# Altium schematic sheet MB_adc_clk.SchDoc: Материнская плата
size 420 x 297 mm; DrawnBy: В.Титов; DocumentNumber: ХХХХ.468179.001 Э3; SheetNumber: 5; SheetTotal: 7; DocumentType: Схема электрическая принципиальная; Title2: Питание процессора
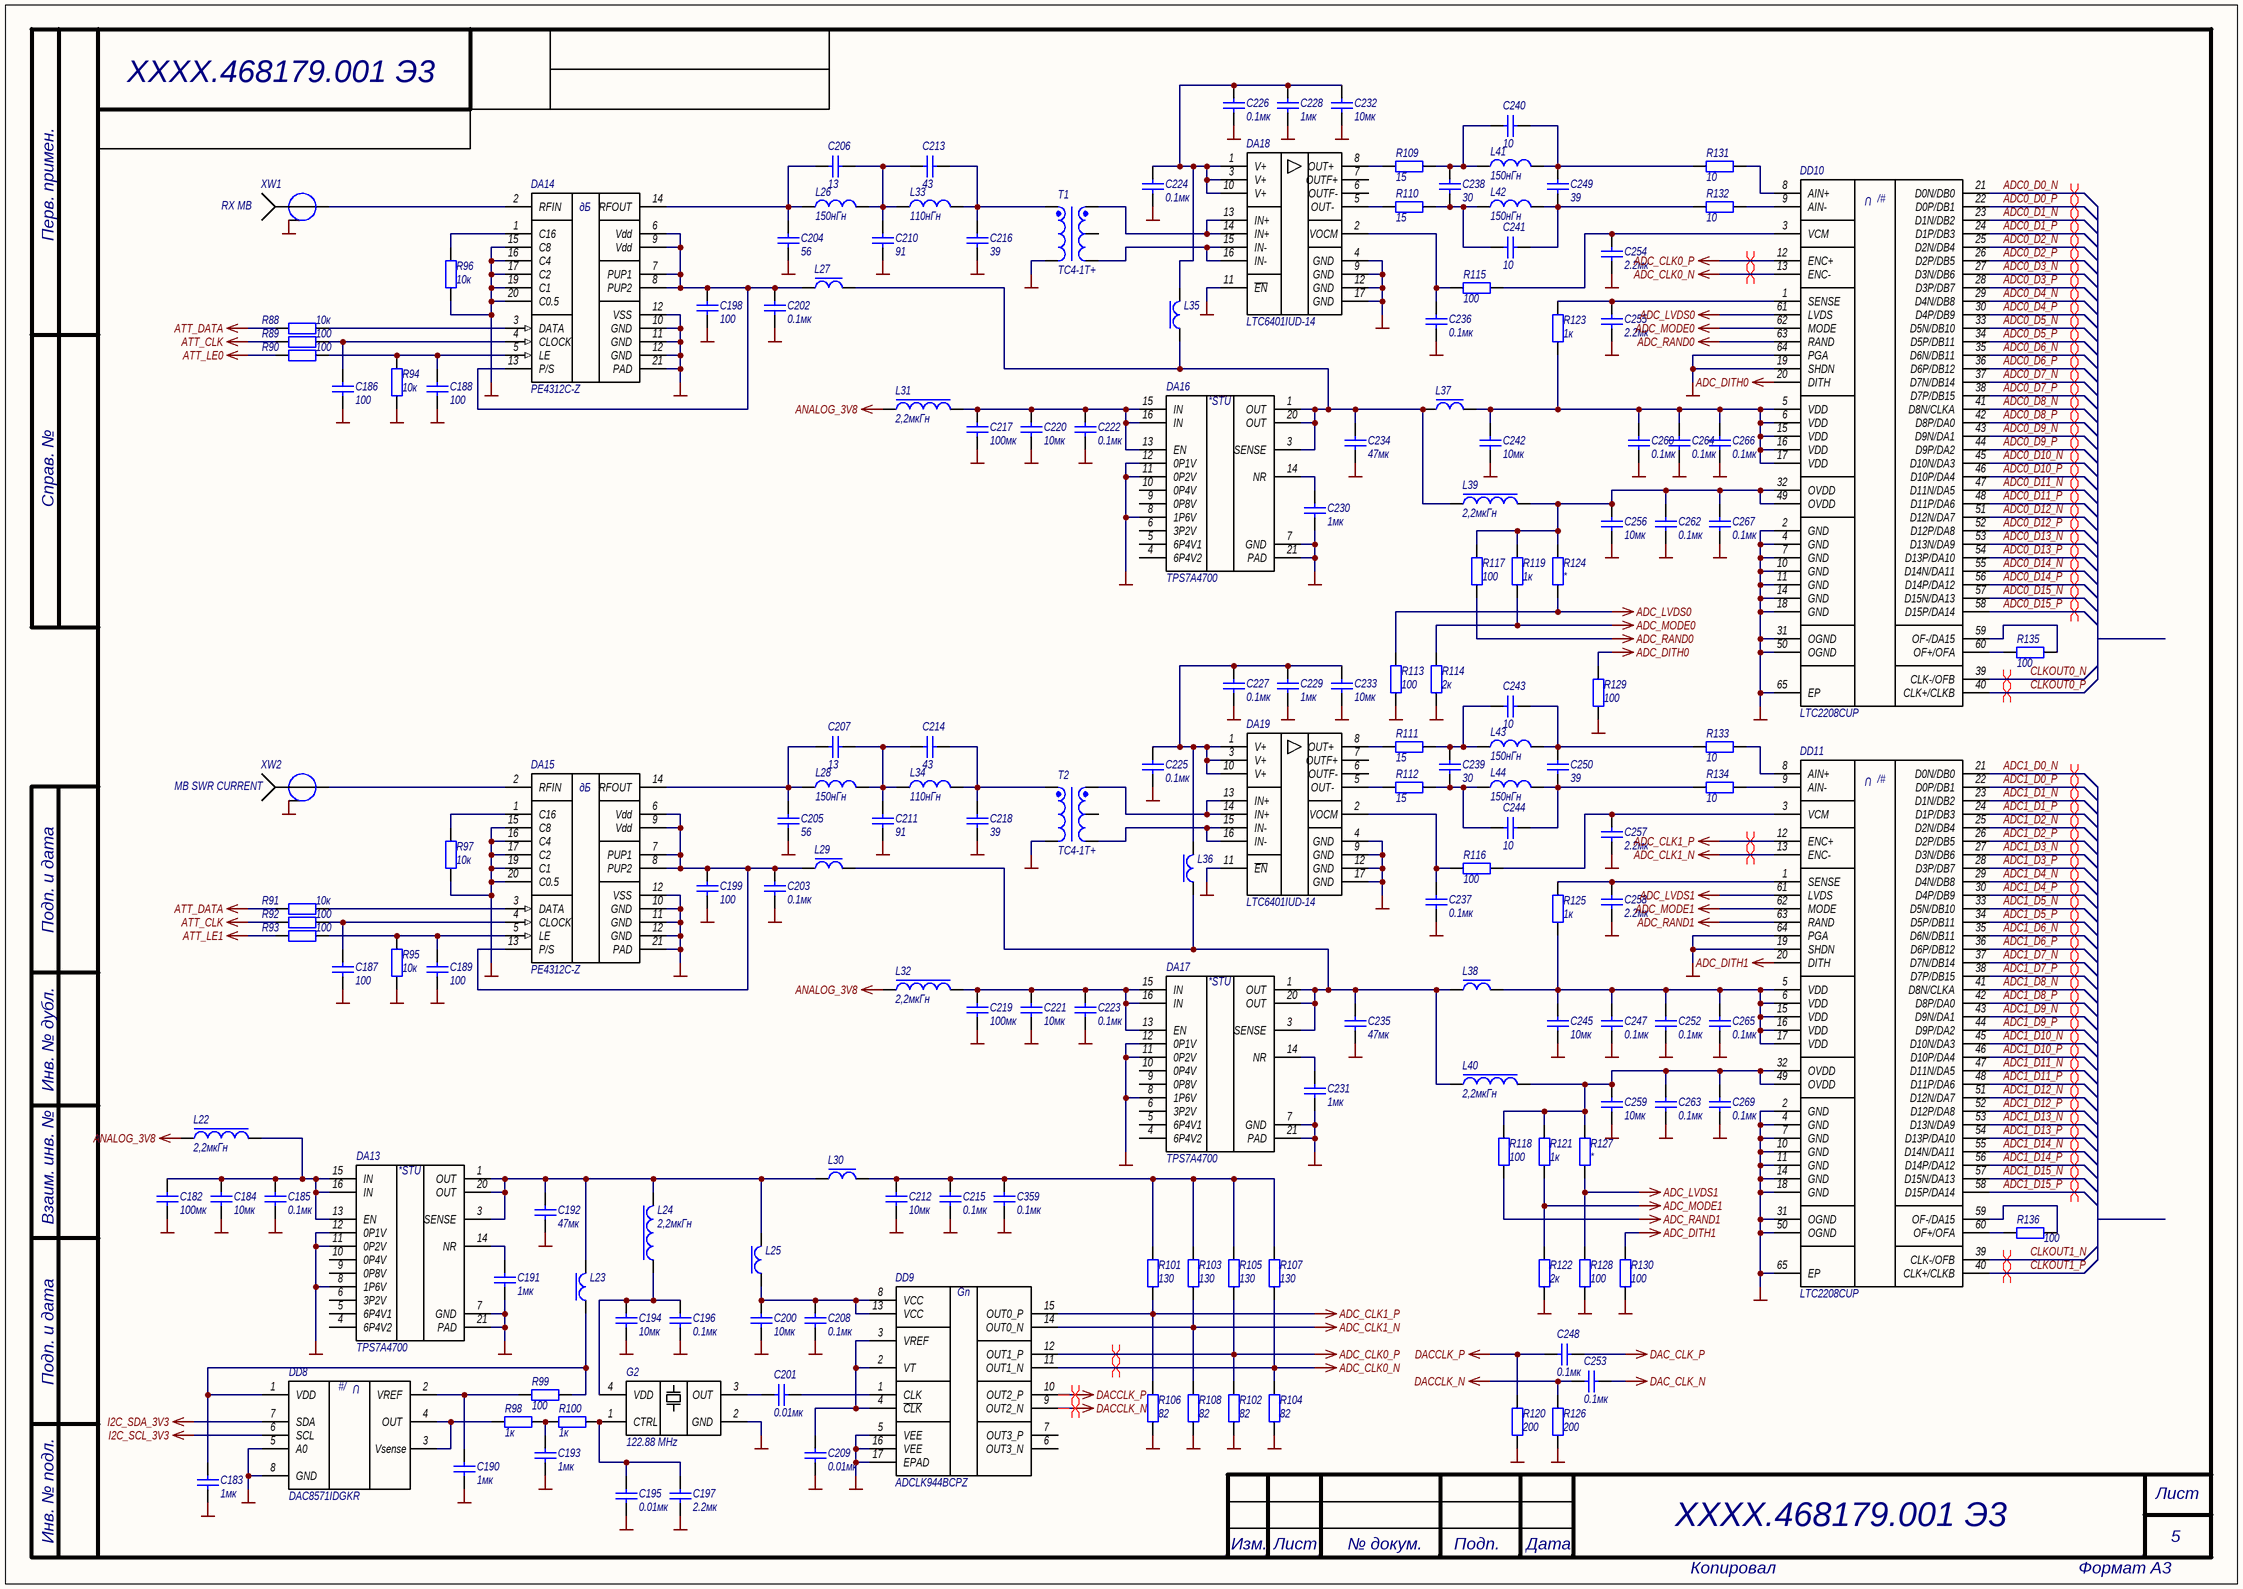
[diagram p0: MB_adc_clk.SchDoc]

## Parts
C182  100мк  [CAPC3216X19L]
C183  1мк  [CAPC1005X06N]
C184  10мк  [CAPC1608X08L]
C185  0.1мк  [CAPC1005X06N]
C186  100  [CAPC1005X06N]
C187  100  [CAPC1005X06N]
C188  100  [CAPC1005X06N]
C189  100  [CAPC1005X06N]
C190  1мк  [CAPC1005X06N]
C191  1мк  [CAPC1005X06N]
C192  47мк  [CAPC2012X12L]
C193  1мк  [CAPC1005X06N]
C194  10мк  [CAPC1608X08L]
C195  0.01мк  [CAPC1005X06N]
C196  0.1мк  [CAPC1005X06N]
C197  2.2мк  [CAPC1005X06N]
C198  100  [CAPC1005X06N]
C199  100  [CAPC1005X06N]
C200  10мк  [CAPC1608X08L]
C201  0.01мк  [CAPC1005X06N]
C202  0.1мк  [CAPC1005X06N]
C203  0.1мк  [CAPC1005X06N]
C204  56  [CAPC1005X06N]
C205  56  [CAPC1005X06N]
C206  13  [CAPC1005X06N]
C207  13  [CAPC1005X06N]
C208  0.1мк  [CAPC1005X06N]
C209  0.01мк  [CAPC1005X06N]
C210  91  [CAPC1005X06N]
C211  91  [CAPC1005X06N]
C212  10мк  [CAPC1608X08L]
C213  43  [CAPC1005X06N]
C214  43  [CAPC1005X06N]
C215  0.1мк  [CAPC1005X06N]
C216  39  [CAPC1005X06N]
C217  100мк  [CAPC3216X19L]
C218  39  [CAPC1005X06N]
C219  100мк  [CAPC3216X19L]
C220  10мк  [CAPC1608X08L]
C221  10мк  [CAPC1608X08L]
C222  0.1мк  [CAPC1005X06N]
C223  0.1мк  [CAPC1005X06N]
C224  0.1мк  [CAPC1005X06N]
C225  0.1мк  [CAPC1005X06N]
C226  0.1мк  [CAPC1005X06N]
C227  0.1мк  [CAPC1005X06N]
C228  1мк  [CAPC1005X06N]
C229  1мк  [CAPC1005X06N]
C230  1мк  [CAPC1005X06N]
C231  1мк  [CAPC1005X06N]
C232  10мк  [CAPC1608X08L]
C233  10мк  [CAPC1608X08L]
C234  47мк  [CAPC2012X12L]
C235  47мк  [CAPC2012X12L]
C236  0.1мк  [CAPC1005X06N]
C237  0.1мк  [CAPC1005X06N]
C238  30  [CAPC1005X06N]
C239  30  [CAPC1005X06N]
C240  10  [CAPC1005X06N]
C241  10  [CAPC1005X06N]
C242  10мк  [CAPC1608X08L]
C243  10  [CAPC1005X06N]
C244  10  [CAPC1005X06N]
C245  10мк  [CAPC1608X08L]
C247  0.1мк  [CAPC1005X06N]
C248  0.1мк  [CAPC1005X06N]
C249  39  [CAPC1005X06N]
C250  39  [CAPC1005X06N]
C252  0.1мк  [CAPC1005X06N]
C253  0.1мк  [CAPC1005X06N]
C254  2.2мк  [CAPC1005X06N]
C255  2.2мк  [CAPC1005X06N]
C256  10мк  [CAPC1608X08L]
C257  2.2мк  [CAPC1005X06N]
C258  2.2мк  [CAPC1005X06N]
C259  10мк  [CAPC1608X08L]
C260  0.1мк  [CAPC1005X06N]
C262  0.1мк  [CAPC1005X06N]
C263  0.1мк  [CAPC1005X06N]
C264  0.1мк  [CAPC1005X06N]
C265  0.1мк  [CAPC1005X06N]
C266  0.1мк  [CAPC1005X06N]
C267  0.1мк  [CAPC1005X06N]
C269  0.1мк  [CAPC1005X06N]
C359  0.1мк  [CAPC1005X06N]
DA13  TPS7A4700  [QFN65P500X500X100_HS-21L]
DA14  PE4312C-Z  [QFN50P400X400X80_HS-21L]
DA15  PE4312C-Z  [QFN50P400X400X80_HS-21L]
DA16  TPS7A4700  [QFN65P500X500X100_HS-21L]
DA17  TPS7A4700  [QFN65P500X500X100_HS-21L]
DA18  LTC6401IUD-14  [QFN50P300X300X75_HS-17L]
DA19  LTC6401IUD-14  [QFN50P300X300X75_HS-17L]
DD8  DAC8571IDGKR  [TSOP65P490X110-8L]
DD9  ADCLK944BCPZ  [QFN50P300X300X100_HS-17L]
DD10  LTC2208CUP  [QFN50P900X900X100_HS-65L]
DD11  LTC2208CUP  [QFN50P900X900X100_HS-65L]
G2  122.88 MHz  [CVHD-950 Model]
L22  2,2мкГн  [CSAB0420]
L23  BLM18PG121SN1D  [INDC1608X08L]  (value not drawn)
L24  2,2мкГн  [CSAB0420]
L25  BLM18PG121SN1D  [INDC1608X08L]  (value not drawn)
L26  150нГн  [INDC0805CS]
L27  BLM18PG121SN1D  [INDC1608X08L]  (value not drawn)
L28  150нГн  [INDC0805CS]
L29  BLM18PG121SN1D  [INDC1608X08L]  (value not drawn)
L30  BLM18PG121SN1D  [INDC1608X08L]  (value not drawn)
L31  2,2мкГн  [CSAB0420]
L32  2,2мкГн  [CSAB0420]
L33  110нГн  [INDC0805CS]
L34  110нГн  [INDC0805CS]
L35  BLM18PG121SN1D  [INDC1608X08L]  (value not drawn)
L36  BLM18PG121SN1D  [INDC1608X08L]  (value not drawn)
L37  BLM18PG121SN1D  [INDC1608X08L]  (value not drawn)
L38  BLM18PG121SN1D  [INDC1608X08L]  (value not drawn)
L39  2,2мкГн  [CSAB0420]
L40  2,2мкГн  [CSAB0420]
L41  150нГн  [INDC0805CS]
L42  150нГн  [INDC0805CS]
L43  150нГн  [INDC0805CS]
L44  150нГн  [INDC0805CS]
R88  10к  [RESC1005X06N]
R89  100  [RESC1005X06N]
R90  100  [RESC1005X06N]
R91  10к  [RESC1005X06N]
R92  100  [RESC1005X06N]
R93  100  [RESC1005X06N]
R94  10к  [RESC1005X06N]
R95  10к  [RESC1005X06N]
R96  10к  [RESC1005X06N]
R97  10к  [RESC1005X06N]
R98  1к  [RESC1005X06N]
R99  100  [RESC1005X06N]
R100  1к  [RESC1005X06N]
R101  130  [RESC1005X06N]
R102  82  [RESC1005X06N]
R103  130  [RESC1005X06N]
R104  82  [RESC1005X06N]
R105  130  [RESC1005X06N]
R106  82  [RESC1005X06N]
R107  130  [RESC1005X06N]
R108  82  [RESC1005X06N]
R109  15  [RESC1005X06N]
R110  15  [RESC1005X06N]
R111  15  [RESC1005X06N]
R112  15  [RESC1005X06N]
R113  100  [RESC1005X06N]
R114  2к  [RESC1005X06N]
R115  100  [RESC1005X06N]
R116  100  [RESC1005X06N]
R117  100  [RESC1005X06N]
R118  100  [RESC1005X06N]
R119  1к  [RESC1005X06N]
R120  200  [RESC1005X06N]
R121  1к  [RESC1005X06N]
R122  2к  [RESC1005X06N]
R123  1к  [RESC1005X06N]
R124  *  [RESC1005X06N]
R125  1к  [RESC1005X06N]
R126  200  [RESC1005X06N]
R127  *  [RESC1005X06N]
R128  100  [RESC1005X06N]
R129  100  [RESC1005X06N]
R130  100  [RESC1005X06N]
R131  10  [RESC1005X06N]
R132  10  [RESC1005X06N]
R133  10  [RESC1005X06N]
R134  10  [RESC1005X06N]
R135  100  [RESC1005X06N]
R136  100  [RESC1005X06N]
T1  TC4-1T+  [SM-22 package]
T2  TC4-1T+  [SM-22 package]
XW1  SMA-JR  [SMA-JR]  (value not drawn)
XW2  SMA-JR  [SMA-JR]  (value not drawn)

## Nets
ADC_CLK0_N: DD9.11(OUT1_N) DD10.13(ENC-) R104.1 R107.2
ADC_CLK0_P: DD9.12(OUT1_P) DD10.12(ENC+) R102.1 R105.2
ADC_CLK1_N: DD9.14(OUT0_N) DD11.13(ENC-) R103.2 R108.1
ADC_CLK1_P: DD9.15(OUT0_P) DD11.12(ENC+) R101.2 R106.1
ADC_DITH0: DD10.20(DITH) R129.1
ADC_DITH1: DD11.20(DITH) R130.1
ADC_LVDS0: DD10.61(LVDS) R113.1 R124.2
ADC_LVDS1: DD11.61(LVDS) R127.2 R128.1
ADC_MODE0: DD10.62(MODE) R114.1 R119.2
ADC_MODE1: DD11.62(MODE) R121.2 R122.1
ADC_RAND0: DD10.63(RAND) R117.2
ADC_RAND1: DD11.63(RAND) R118.2
ANALOG_3V8: L22.1 L31.1 L32.1
ATT_CLK: R89.2 R92.2
ATT_DATA: R88.2 R91.2
ATT_LE0: R90.2
ATT_LE1: R93.2
DAC_CLK_N: C253.1
DAC_CLK_P: C248.1
DACCLK_N: C253.2 DD9.9(OUT2_N) R126.1
DACCLK_P: C248.2 DD9.10(OUT2_P) R120.1
GND: C182.1 C183.2 C184.1 C185.1 C186.1 C187.1 C188.1 C189.1 C190.2 C191.1 C192.1 C193.2 C194.1 C195.2 C196.1 C197.1 C198.1 C199.1 C200.1 C202.1 C203.1 C204.1 C205.1 C208.1 C209.2 C210.1 C211.1 C212.1 C215.1 C216.1 C217.1 C218.1 C219.1 C220.1 C221.1 C222.1 C223.1 C224.1 C225.1 C226.1 C227.1 C228.1 C229.1 C230.1 C231.1 C232.1 C233.1 C234.1 C235.1 C236.1 C237.1 C242.1 C245.1 C247.1 C252.1 C254.1 C255.1 C256.1 C257.1 C258.1 C259.1 C260.1 C262.1 C263.1 C264.1 C265.1 C266.1 C267.1 C269.1 C359.1 DA13.7(GND) DA13.8(1P6V) DA13.11(0P2V) DA13.12(0P1V) DA13.21(PAD) DA14.10(GND) DA14.11(GND) DA14.12(VSS) DA14.15(C8) DA14.16(C4) DA14.17(C2) DA14.19(C1) DA14.20(C0.5) DA14.21(PAD) DA15.10(GND) DA15.11(GND) DA15.12(VSS) DA15.15(C8) DA15.16(C4) DA15.17(C2) DA15.19(C1) DA15.20(C0.5) DA15.21(PAD) DA16.7(GND) DA16.8(1P6V) DA16.11(0P2V) DA16.12(0P1V) DA16.21(PAD) DA17.7(GND) DA17.8(1P6V) DA17.11(0P2V) DA17.12(0P1V) DA17.21(PAD) DA18.4(GND) DA18.9(GND) DA18.11(~{EN}) DA18.12(GND) DA18.17(GND) DA19.4(GND) DA19.9(GND) DA19.11(~{EN}) DA19.12(GND) DA19.17(GND) DD8.5(A0) DD8.8(GND) DD9.5(VEE) DD9.16(VEE) DD9.17(EPAD) DD10.2(GND) DD10.4(GND) DD10.7(GND) DD10.10(GND) DD10.11(GND) DD10.14(GND) DD10.18(GND) DD10.19(SHDN) DD10.31(OGND) DD10.50(OGND) DD10.64(PGA) DD10.65(EP) DD11.2(GND) DD11.4(GND) DD11.7(GND) DD11.10(GND) DD11.11(GND) DD11.14(GND) DD11.18(GND) DD11.19(SHDN) DD11.31(OGND) DD11.50(OGND) DD11.64(PGA) DD11.65(EP) G2.2(GND) R94.2 R95.2 R96.1 R97.1 R102.2 R104.2 R106.2 R108.2 R113.2 R114.2 R120.2 R122.2 R126.2 R128.2 R129.2 R130.2 T1.4(PRIMARY) T2.4(PRIMARY) XW1.2 XW2.2
I2C_SCL_3V3: DD8.6(SCL)
I2C_SDA_3V3: DD8.7(SDA)
ADC0_D0_N: DD10.21(D0N/DB0)
ADC0_D0_P: DD10.22(D0P/DB1)
ADC0_D1_N: DD10.23(D1N/DB2)
ADC0_D1_P: DD10.24(D1P/DB3)
ADC0_D2_N: DD10.25(D2N/DB4)
ADC0_D2_P: DD10.26(D2P/DB5)
ADC0_D3_N: DD10.27(D3N/DB6)
ADC0_D3_P: DD10.28(D3P/DB7)
ADC0_D4_N: DD10.29(D4N/DB8)
ADC0_D4_P: DD10.30(D4P/DB9)
ADC0_D5_N: DD10.33(D5N/DB10)
ADC0_D5_P: DD10.34(D5P/DB11)
ADC0_D6_N: DD10.35(D6N/DB11)
ADC0_D6_P: DD10.36(D6P/DB12)
ADC0_D7_N: DD10.37(D7N/DB14)
ADC0_D7_P: DD10.38(D7P/DB15)
ADC0_D8_N: DD10.41(D8N/CLKA)
ADC0_D8_P: DD10.42(D8P/DA0)
ADC0_D9_N: DD10.43(D9N/DA1)
ADC0_D9_P: DD10.44(D9P/DA2)
ADC0_D10_N: DD10.45(D10N/DA3)
ADC0_D10_P: DD10.46(D10P/DA4)
ADC0_D11_N: DD10.47(D11N/DA5)
ADC0_D11_P: DD10.48(D11P/DA6)
ADC0_D12_N: DD10.51(D12N/DA7)
ADC0_D12_P: DD10.52(D12P/DA8)
ADC0_D13_N: DD10.53(D13N/DA9)
ADC0_D13_P: DD10.54(D13P/DA10)
ADC0_D14_N: DD10.55(D14N/DA11)
ADC0_D14_P: DD10.56(D14P/DA12)
ADC0_D15_N: DD10.57(D15N/DA13)
ADC0_D15_P: DD10.58(D15P/DA14)
ADC1_D0_N: DD11.21(D0N/DB0)
ADC1_D0_P: DD11.22(D0P/DB1)
ADC1_D1_N: DD11.23(D1N/DB2)
ADC1_D1_P: DD11.24(D1P/DB3)
ADC1_D2_N: DD11.25(D2N/DB4)
ADC1_D2_P: DD11.26(D2P/DB5)
ADC1_D3_N: DD11.27(D3N/DB6)
ADC1_D3_P: DD11.28(D3P/DB7)
ADC1_D4_N: DD11.29(D4N/DB8)
ADC1_D4_P: DD11.30(D4P/DB9)
ADC1_D5_N: DD11.33(D5N/DB10)
ADC1_D5_P: DD11.34(D5P/DB11)
ADC1_D6_N: DD11.35(D6N/DB11)
ADC1_D6_P: DD11.36(D6P/DB12)
ADC1_D7_N: DD11.37(D7N/DB14)
ADC1_D7_P: DD11.38(D7P/DB15)
ADC1_D8_N: DD11.41(D8N/CLKA)
ADC1_D8_P: DD11.42(D8P/DA0)
ADC1_D9_N: DD11.43(D9N/DA1)
ADC1_D9_P: DD11.44(D9P/DA2)
ADC1_D10_N: DD11.45(D10N/DA3)
ADC1_D10_P: DD11.46(D10P/DA4)
ADC1_D11_N: DD11.47(D11N/DA5)
ADC1_D11_P: DD11.48(D11P/DA6)
ADC1_D12_N: DD11.51(D12N/DA7)
ADC1_D12_P: DD11.52(D12P/DA8)
ADC1_D13_N: DD11.53(D13N/DA9)
ADC1_D13_P: DD11.54(D13P/DA10)
ADC1_D14_N: DD11.55(D14N/DA11)
ADC1_D14_P: DD11.56(D14P/DA12)
ADC1_D15_N: DD11.57(D15N/DA13)
ADC1_D15_P: DD11.58(D15P/DA14)
CLKOUT0_N: DD10.39(CLK-/OFB)
CLKOUT0_P: DD10.40(CLK+/CLKB)
CLKOUT1_N: DD11.39(CLK-/OFB)
CLKOUT1_P: DD11.40(CLK+/CLKB)
NetC182_2: C182.2 C184.2 C185.2 DA13.13(EN) DA13.15(IN) DA13.16(IN) L22.2
NetC183_1: C183.1 DD8.1(VDD) L23.1 R99.2
NetC186_2: C186.2 DA14.4(CLOCK) R89.1
NetC187_2: C187.2 DA15.4(CLOCK) R92.1
NetC188_2: C188.2 DA14.5(LE) R90.1 R94.1
NetC189_2: C189.2 DA15.5(LE) R93.1 R95.1
NetC190_1: C190.1 DD8.2(VREF) R99.1
NetC191_2: C191.2 DA13.14(NR)
NetC192_2: C192.2 DA13.1(OUT) DA13.3(SENSE) DA13.20(OUT) L23.2 L24.2 L25.2 L30.1
NetC193_1: C193.1 R98.2 R100.1
NetC194_2: C194.2 C196.2 G2.4(VDD) L24.1
NetC195_1: C195.1 C197.2 G2.1(CTRL) R100.2
NetC198_2: C198.2 C202.2 DA14.6(Vdd) DA14.7(PUP1) DA14.8(PUP2) DA14.9(Vdd) DA14.13(P/S) L27.1
NetC199_2: C199.2 C203.2 DA15.6(Vdd) DA15.7(PUP1) DA15.8(PUP2) DA15.9(Vdd) DA15.13(P/S) L29.1
NetC200_2: C200.2 C208.2 DD9.8(VCC) DD9.13(VCC) L25.1
NetC201_1: C201.1 DD9.1(CLK)
NetC201_2: C201.2 G2.3(OUT)
NetC204_2: C204.2 C206.2 DA14.14(RFOUT) L26.1
NetC205_2: C205.2 C207.2 DA15.14(RFOUT) L28.1
NetC206_1: C206.1 C210.2 C213.2 L26.2 L33.1
NetC207_1: C207.1 C211.2 C214.2 L28.2 L34.1
NetC209_1: C209.1 DD9.2(VT) DD9.3(VREF) DD9.4(~{CLK})
NetC212_2: C212.2 C215.2 C359.2 L30.2 R101.1 R103.1 R105.1 R107.1
NetC213_1: C213.1 C216.2 L33.2 T1.5(PRIMARY_DOT)
NetC214_1: C214.1 C218.2 L34.2 T2.5(PRIMARY_DOT)
NetC217_2: C217.2 C220.2 C222.2 DA16.13(EN) DA16.15(IN) DA16.16(IN) L31.2
NetC219_2: C219.2 C221.2 C223.2 DA17.13(EN) DA17.15(IN) DA17.16(IN) L32.2
NetC224_2: C224.2 C226.2 C228.2 C232.2 DA18.1(V+) DA18.3(V+) DA18.10(V+) L35.2
NetC225_2: C225.2 C227.2 C229.2 C233.2 DA19.1(V+) DA19.3(V+) DA19.10(V+) L36.2
NetC230_2: C230.2 DA16.14(NR)
NetC231_2: C231.2 DA17.14(NR)
NetC234_2: C234.2 DA16.1(OUT) DA16.3(SENSE) DA16.20(OUT) L27.2 L35.1 L37.1 L39.1
NetC235_2: C235.2 DA17.1(OUT) DA17.3(SENSE) DA17.20(OUT) L29.2 L36.1 L38.1 L40.1
NetC236_2: C236.2 DA18.2(VOCM) R115.1
NetC237_2: C237.2 DA19.2(VOCM) R116.1
NetC238_1: C238.1 C241.2 L42.1 R110.2
NetC238_2: C238.2 C240.2 L41.1 R109.2
NetC239_1: C239.1 C244.2 L44.1 R112.2
NetC239_2: C239.2 C243.2 L43.1 R111.2
NetC240_1: C240.1 C249.2 L41.2 R131.1
NetC241_1: C241.1 C249.1 L42.2 R132.1
NetC242_2: C242.2 C260.2 C264.2 C266.2 DD10.5(VDD) DD10.6(VDD) DD10.15(VDD) DD10.16(VDD) DD10.17(VDD) L37.2 R123.2
NetC243_1: C243.1 C250.2 L43.2 R133.1
NetC244_1: C244.1 C250.1 L44.2 R134.1
NetC245_2: C245.2 C247.2 C252.2 C265.2 DD11.5(VDD) DD11.6(VDD) DD11.15(VDD) DD11.16(VDD) DD11.17(VDD) L38.2 R125.2
NetC254_2: C254.2 DD10.3(VCM) R115.2
NetC255_2: C255.2 DD10.1(SENSE) R123.1
NetC256_2: C256.2 C262.2 C267.2 DD10.32(OVDD) DD10.49(OVDD) L39.2 R117.1 R119.1 R124.1
NetC257_2: C257.2 DD11.3(VCM) R116.2
NetC258_2: C258.2 DD11.1(SENSE) R125.1
NetC259_2: C259.2 C263.2 C269.2 DD11.32(OVDD) DD11.49(OVDD) L40.2 R118.1 R121.1 R127.1
NetDA14_1: DA14.1(C16) R96.2
NetDA14_2: DA14.2(RFIN) XW1.1
NetDA14_3: DA14.3(DATA) R88.1
NetDA15_1: DA15.1(C16) R97.2
NetDA15_2: DA15.2(RFIN) XW2.1
NetDA15_3: DA15.3(DATA) R91.1
NetDA18_5: DA18.5(GND) R110.1
NetDA18_8: DA18.8(OUT+) R109.1
NetDA18_13: DA18.13(IN+) DA18.14(IN+) T1.1(SECONDARY_DOT)
NetDA18_15: DA18.15(IN-) DA18.16(IN-) T1.3(SECONDARY)
NetDA19_5: DA19.5(GND) R112.1
NetDA19_8: DA19.8(OUT+) R111.1
NetDA19_13: DA19.13(IN+) DA19.14(IN+) T2.1(SECONDARY_DOT)
NetDA19_15: DA19.15(IN-) DA19.16(IN-) T2.3(SECONDARY)
NetDD8_3: DD8.3(Vsense) DD8.4(OUT) R98.1
NetDD10_8: DD10.8(AIN+) R131.2
NetDD10_9: DD10.9(AIN-) R132.2
NetDD10_59: DD10.59(OF-/DA15) R135.1
NetDD10_60: DD10.60(OF+/OFA) R135.2
NetDD11_8: DD11.8(AIN+) R133.2
NetDD11_9: DD11.9(AIN-) R134.2
NetDD11_59: DD11.59(OF-/DA15) R136.1
NetDD11_60: DD11.60(OF+/OFA) R136.2

Not connected (* = marked no-connect by the designer): DA13 4(6P4V2) 5(6P4V1) 6(3P2V) 9(0P8V) 10(0P4V); DA16 4(6P4V2) 5(6P4V1) 6(3P2V) 9(0P8V) 10(0P4V); DA17 4(6P4V2) 5(6P4V1) 6(3P2V) 9(0P8V) 10(0P4V); DA18 6(OUTF-) 7(OUTF+); DA19 6(OUTF-) 7(OUTF+); DD9 6(OUT3_N) 7(OUT3_P); T1 2(SECONARY_CT); T2 2(SECONARY_CT)

## Layout directives
differential pair: ADC0_D0_N, ADC0_D0_P, ADC0_D1_N, ADC0_D1_P, ADC0_D2_N, ADC0_D2_P, ADC0_D3_N, ADC0_D3_P, ADC0_D4_N, ADC0_D4_P, ADC0_D5_N, ADC0_D5_P, ADC0_D6_N, ADC0_D6_P, ADC0_D7_N, ADC0_D7_P, ADC0_D8_N, ADC0_D8_P, ADC0_D9_N, ADC0_D9_P, ADC0_D10_N, ADC0_D10_P, ADC0_D11_N, ADC0_D11_P, ADC0_D12_N, ADC0_D12_P, ADC0_D13_N, ADC0_D13_P, ADC0_D14_N, ADC0_D14_P, ADC0_D15_N, ADC0_D15_P, ADC1_D0_N, ADC1_D0_P, ADC1_D1_N, ADC1_D1_P, ADC1_D2_N, ADC1_D2_P, ADC1_D3_N, ADC1_D3_P, ADC1_D4_N, ADC1_D4_P, ADC1_D5_N, ADC1_D5_P, ADC1_D6_N, ADC1_D6_P, ADC1_D7_N, ADC1_D7_P, ADC1_D8_N, ADC1_D8_P, ADC1_D9_N, ADC1_D9_P, ADC1_D10_N, ADC1_D10_P, ADC1_D11_N, ADC1_D11_P, ADC1_D12_N, ADC1_D12_P, ADC1_D13_N, ADC1_D13_P, ADC1_D14_N, ADC1_D14_P, ADC1_D15_N, ADC1_D15_P, ADC_CLK0_N, ADC_CLK0_P, ADC_CLK1_N, ADC_CLK1_P, CLKOUT0_N, CLKOUT0_P, CLKOUT1_N, CLKOUT1_P, DACCLK_N, DACCLK_P

## Notes on the sheet
- (near XW1) RX MB
- (near XW2) MB SWR CURRENT
- Перв. примен.
- Справ. №
- Подп. и дата
- Инв. № дубл.
- Взаим. инв. №
- Инв. № подл.
- Лист
- Изм.
- № докум.
- Подп.
- Дата
- Копировал
- Формат А3
- (in symbol Микросхема ADCLK944BCPZ) Gn
- (in symbol Микросхема DAC8571IDGKR) U; #/
- (in symbol Микросхема LTC2208CUP) U; /#
- (in symbol Микросхема PE4312C-Z) дБ
- (in symbol Микросхема TPS7A4700RGW) *STU

## Library data of the parts
C182 C217 C219 = Кер.ЧИП конд. 1206 100мкФ X5R 20% 6.3В: Кер. ЧИП-конденсатор; Manufacturer: Murata; ManufacturerPartNumber: GRM31CR60J107ME39L; Power/Voltage: 6.3В; TKE: X5R; Tolerance: ±20%; Value: 100мк
C183 C190 C191 C193 C228-C231 = Кер.ЧИП конд. 0402 1мкФ X5R 10%, 10В: Кер. ЧИП-конденсатор; Power/Voltage: 10В; TKE: X5R; Tolerance: ±10%; Value: 1мк; PackageReference: 0402
C184 C194 C200 C212 C220 C221 C232 C233 C242 C245 C256 C259 = Кер.ЧИП конд. 0603 10мкФ X5R 20% 6.3В: Кер. ЧИП-конденсатор; Manufacturer: Murata; ManufacturerPartNumber: GRM188R61A106KE69D; Power/Voltage: 6.3В; TKE: X5R; Tolerance: ±20%; Value: 10мк
C185 C196 C202 C203 C208 C215 C222-C227 C236 C237 C247 C248 C252 C253 C260 C262-C267 C269 C359 = Кер.ЧИП конд. 0402 0.1мкФ X7R 10%, 16В: Кер. ЧИП-конденсатор; Power/Voltage: 16В; TKE: X7R; Tolerance: ±10%; PackageReference: 0402; Value: 0.1мк
C186-C189 C198 C199 = Кер.ЧИП конд. 0402 100пФ NPO 5%, 50В: Кер. ЧИП-конденсатор; Power/Voltage: 50В; TKE: NPO; Tolerance: ±5%; PackageReference: 0402; Value: 100
C192 C234 C235 = Кер.ЧИП конд. 0805 47мкФ X5R 20% 10В: Кер. ЧИП-конденсатор; Manufacturer: Murata; ManufacturerPartNumber: GRM21BR61A476ME15L; Power/Voltage: 10В; TKE: X5R; Tolerance: ±20%; Value: 47мк
C195 C201 C209 = Кер.ЧИП конд. 0402 0.01мкФ X7R 10%, 50В: Кер. ЧИП-конденсатор; Power/Voltage: 50В; TKE: X7R; Tolerance: ±20%; Value: 0.01мк
C197 C254 C255 C257 C258 = Кер.ЧИП конд. 0402 2.2мкФ X5R 20%, 6.3В: Кер. ЧИП-конденсатор; Power/Voltage: 6.3В; TKE: X5R; Tolerance: ±20%; PackageReference: 0402; Value: 2.2мк
C204 C205 = Кер.ЧИП конд. 0402 56пФ NPO 5%, 50В: Кер. ЧИП-конденсатор; Power/Voltage: 50В; TKE: NPO; Tolerance: ±5%; PackageReference: 0402; Value: 56
C206 C207 = Кер.ЧИП конд. 0402 13пФ NPO 5%, 50В: Кер. ЧИП-конденсатор; Power/Voltage: 50В; TKE: NPO; Tolerance: ±5%; Value: 13; PackageReference: 0402
C210 C211 = Кер.ЧИП конд. 0402 91пФ NPO 5%, 50В: Кер. ЧИП-конденсатор; Power/Voltage: 50В; TKE: NPO; Tolerance: ±5%; PackageReference: 0402; Value: 91
C213 C214 = Кер.ЧИП конд. 0402 43пФ NPO 5%, 50В: Кер. ЧИП-конденсатор; Power/Voltage: 50В; TKE: NPO; Tolerance: ±5%; Value: 43; PackageReference: 0402
C216 C218 C249 C250 = Кер.ЧИП конд. 0402 39пФ NPO 5%, 50В: Кер. ЧИП-конденсатор; Power/Voltage: 50В; TKE: NPO; Tolerance: ±5%; PackageReference: 0402; Value: 39
C238 C239 = Кер.ЧИП конд. 0402 30пФ NPO 5%, 50В: Кер. ЧИП-конденсатор; Power/Voltage: 50В; TKE: NPO; Tolerance: ±5%; PackageReference: 0402; Value: 30
C240 C241 C243 C244 = Кер.ЧИП конд. 0402 10пФ NPO 5%, 50В: Кер. ЧИП-конденсатор; Power/Voltage: 50В; TKE: NPO; Tolerance: ±5%; PackageReference: 0402; Value: 10
DA13 DA16 DA17 = Микросхема TPS7A4700RGW: 36-V, 1-A, 4-µVRMS, RF LDO Voltage Regulator; Manufacturer: TI; Value: TPS7A4700; ComponentLink1Description: datasheet; ComponentLink1URL: http://www.ti.com/lit/ds/symlink/tps7a47.pdf
DA14 DA15 = Микросхема PE4312C-Z: RF Digital Step Attenuator 6-bit, 31.5 dB, 1 MHz–4 GHz; Manufacturer: Peregrine; Value: PE4312C-Z; ComponentLink1Description: datasheet; ComponentLink1URL: https://www.psemi.com/pdf/datasheets/pe4312ds.pdf
DA18 DA19 = Микросхема LTC6401IUD-14: 2GHz Low Noise, Low  Distortion Differential ADC  Driver for DC-140MHz; Manufacturer: LINEAR TECHNOLOGY; Value: LTC6401IUD-14; ComponentLink1Description: datasheet; ComponentLink1URL: http://cds.linear.com/docs/en/datasheet/640114f.pdf
DD8 = Микросхема DAC8571IDGKR: 16-BIT, LOW POWER, VOLTAGE OUTPUT, I2C INTERFACE DIGITAL-TO-ANALOG  CONVERTER; Manufacturer: TI; Value: DAC8571IDGKR; ComponentLink1Description: datasheet; ComponentLink1URL: http://www.ti.com/lit/ds/slas373a/slas373a.pdf
DD9 = Микросхема ADCLK944BCPZ: 2.5 V/3.3 V, Four LVPECL Outputs,  SiGe Clock Fanout Buffer; Manufacturer: TI; Value: ADCLK944BCPZ; ComponentLink1Description: datasheet; ComponentLink1URL: http://www.analog.com/media/en/technical-documentation/data-sheets/ADCLK944.pdf
DD10 DD11 = Микросхема LTC2208CUP: 16-Bit, 130Msps ADC; Manufactured: Linear; Value: LTC2208CUP; ComponentLink1Description: datasheet; ComponentLink1URL: https://www.analog.com/media/en/technical-documentation/data-sheets/2208fc.pdf
G2 = Генератор кварцевый CVHD-950-122.880: 122.88 MHz Ultra-Low Phase Noise Oscillator; Manufacturer: Crystek crystals; Value: 122.88 MHz; ComponentLink1Description: datasheet; ComponentLink1URL: http://www.rakon.com/products/families/tcxo
L22 L24 L31 L32 L39 L40 = ЧИП индуктивность CSAB0420-2R2M: Molding Power Choke; Manufacturer: Vishay; ManufacturerPartNumber: IHLP1616ABER1R0M11; Value: 2,2мкГн
L23 L25 L27 L29 L30 L35-L38 = ЧИП дроссель 0603 BLM18PG121SN1D: SMD EMI Suppression Filter EMIFIL; Manufacturer: Murata; ManufacturerPartNumber: BLM18PG121SN1D; Value: BLM18PG121SN1D
L26 L28 = ЧИП индуктивность 0805CS-151XGL: Value: 150нГн
L33 L34 = ЧИП индуктивность 0805CS-111XGL: Value: 110нГн
L41-L44 = ЧИП индуктивность 0805CS-150XJL: Value: 150нГн
R88 R91 R94-R97 = Чип резистор 0402 10 кОм, 5%: ЧИП-резистор; Tolerance: ±5%; TKE: 100 ppm/°С; PackageReference: 0402; Value: 10к
R89 R90 R92 R93 R99 R113 R115-R118 R128-R130 R135 R136 = Чип резистор 0402 100 Ом, 5%: ЧИП-резистор; Tolerance: ±5%; TKE: 100 ppm/°С; PackageReference: 0402; Value: 100
R98 R100 R119 R121 R123 R125 = Чип резистор 0402 1 кОм, 5%: ЧИП-резистор; Tolerance: ±5%; TKE: 100 ppm/°С; PackageReference: 0402; Value: 1к
R101 R103 R105 R107 = Чип резистор 0402 130 Ом, 5%: ЧИП-резистор; Tolerance: ±5%; TKE: 100 ppm/°С; PackageReference: 0402; Value: 130
R102 R104 R106 R108 = Чип резистор 0402 82 Ом, 5%: ЧИП-резистор; Tolerance: ±5%; TKE: 100 ppm/°С; PackageReference: 0402; Value: 82
R109-R112 = Чип резистор 0402 15 Ом, 5%: ЧИП-резистор; Tolerance: ±5%; TKE: 100 ppm/°С; PackageReference: 0402; Value: 15
R114 R122 = Чип резистор 0402 2 кОм, 5%: ЧИП-резистор; Tolerance: ±5%; TKE: 100 ppm/°С; PackageReference: 0402; Value: 2к
R120 R126 = Чип резистор 0402 200 Ом, 5%: ЧИП-резистор; Tolerance: ±5%; TKE: 100 ppm/°С; PackageReference: 0402; Value: 200
R124 R127 = Чип резистор 0402 *: ЧИП-резистор; Tolerance: ±5%; TKE: 100 ppm/°С; PackageReference: 0402; Value: *
R131-R134 = Чип резистор 0402 10 Ом, 5%: ЧИП-резистор; Tolerance: ±5%; TKE: 100 ppm/°С; PackageReference: 0402; Value: 10
T1 T2 = ЧИП трансформатор TC4-1T+: RF Transformer 50Ω 0.5 to 300 MHz 1:4; Manufacturer: minicircuits; ManufacturerPartNumber: ADT2-1T+; Value: TC4-1T+; ComponentLink1Description: datasheet; ComponentLink1URL: https://ww2.minicircuits.com/pdfs/ADT2-1T+.pdf
XW1 XW2 = Соединитель коаксиальный SMA-JR: SMA-JR Разъем SMA гнездо на плату, прямой угол; Value: SMA-JR; ComponentLink1Description: datasheet; ComponentLink1URL: http://www.brownbear.ru/goods/2243.html